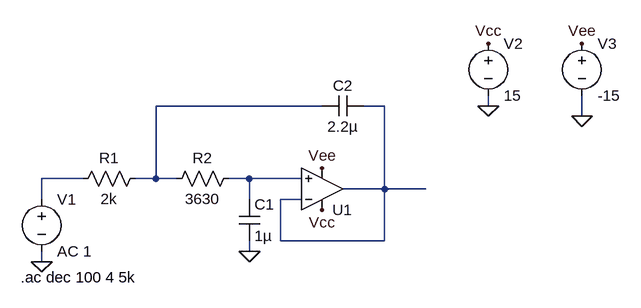
[diagram p0: schematic filtroantialias.asc]
filtroantialias.asc, the LTspice schematic file:
Version 4.1
SHEET 1 880 680
WIRE 208 64 -48 64
WIRE 304 64 272 64
WIRE 464 64 464 48
WIRE 608 80 608 48
WIRE -160 176 -224 176
WIRE -48 176 -48 64
WIRE -48 176 -80 176
WIRE -16 176 -48 176
WIRE 96 176 64 176
WIRE 176 176 96 176
WIRE 304 192 304 64
WIRE 304 192 240 192
WIRE 368 192 304 192
WIRE -224 208 -224 176
WIRE 96 208 96 176
WIRE 176 208 144 208
WIRE 144 272 144 208
WIRE 304 272 304 192
WIRE 304 272 144 272
WIRE 96 288 96 272
WIRE -224 304 -224 288
FLAG 96 288 0
FLAG -224 304 0
FLAG 464 64 0
FLAG 608 80 0
FLAG 464 -32 Vcc
FLAG 608 -32 Vee
FLAG 208 224 Vcc
FLAG 208 160 Vee
SYMBOL OpAmps\\UniversalOpAmp 208 192 M180
SYMATTR InstName U1
SYMBOL res -64 160 R90
WINDOW 0 0 56 VBottom 2
WINDOW 3 32 56 VTop 2
SYMATTR InstName R1
SYMATTR Value 2k
SYMBOL res 80 160 R90
WINDOW 0 0 56 VBottom 2
WINDOW 3 32 56 VTop 2
SYMATTR InstName R2
SYMATTR Value 3630
SYMBOL cap 80 208 R0
SYMATTR InstName C1
SYMATTR Value 1µ
SYMBOL cap 272 48 R90
WINDOW 0 0 32 VBottom 2
WINDOW 3 32 32 VTop 2
SYMATTR InstName C2
SYMATTR Value 2.2µ
SYMBOL voltage -224 192 R0
SYMATTR InstName V1
SYMATTR Value AC 1
SYMBOL voltage 464 -48 R0
SYMATTR InstName V2
SYMATTR Value 15
SYMBOL voltage 608 -48 R0
SYMATTR InstName V3
SYMATTR Value -15
TEXT -256 328 Left 2 !.ac dec 100 4 5k

The netlist it stands for:
* filtroantialias.asc
X§U1 N004 N002 Vcc Vee N002 level1 Avol=1Meg GBW=10Meg Vos=0 En=0 Enk=0 In=0 Ink=0 Rin=500Meg  ; pins In+ In- V+ V- OUT
R1 N001 N003 2k
R2 N004 N001 3630
C1 N004 0 1µ
C2 N002 N001 2.2µ
V1 N003 0 AC 1
V2 Vcc 0 15
V3 Vee 0 -15
.ac dec 100 4 5k
.lib UniversalOpAmp1.lib
.backanno
.end